# Altium schematic sheet TSAL分布图.SchDoc
size A4; SheetNumber: 7; SheetTotal: 9
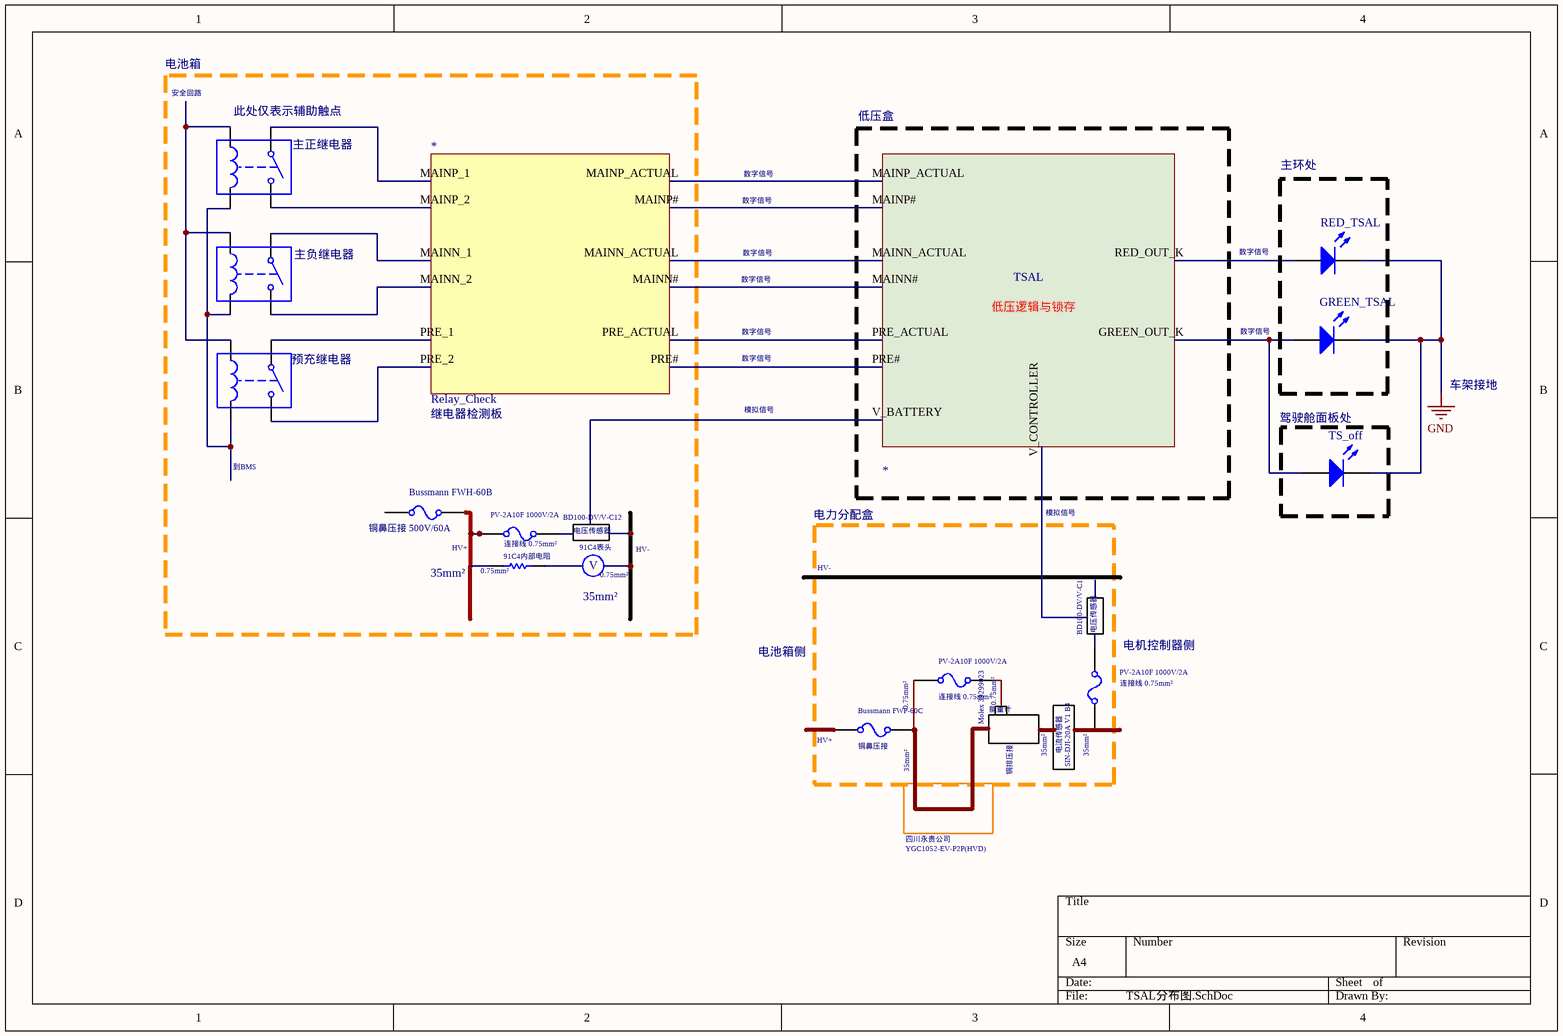
[diagram p0: TSAL分布图.SchDoc]

## Parts
(Parts that share a designator on the sheet are numbered #1, #2 ... from top to bottom, then left to right.)
91C4内部电阻  Resistor  (value not drawn)
*#1  Relay_Check
*#2  TSAL
Bussmann_FWH-60B  Fuse  (value not drawn)
Bussmann_FWP-60C  CURRENT: 铜鼻压接  (hidden comment: Fuse)
GREEN_TSAL  Light-Emitting Diode  (value not drawn)
PV-2A10F_1000V/2A#1  连接线 0.75mm²
PV-2A10F_1000V/2A#2  连接线 0.75mm²
PV-2A10F_1000V/2A#3  连接线 0.75mm²
RED_TSAL  Light-Emitting Diode  (value not drawn)
TS_off  Light-Emitting Diode  (value not drawn)
主正继电器  Single-Pole, Single-Throw Normally Opened Relay  (value not drawn)
主负继电器  Single-Pole, Single-Throw Normally Opened Relay  (value not drawn)
预充继电器  Single-Pole, Single-Throw Normally Opened Relay  (value not drawn)

## Blocks framed on the sheet
主环处: GREEN_TSAL RED_TSAL
驾驶舱面板处: TS_off
电力分配盒: Bussmann_FWP-60C PV-2A10F_1000V/2A#2 PV-2A10F_1000V/2A#3

## Sub-sheets
电池箱 = YGC1052-EV-P2P(HVD): no entries
电池箱 = 能量计: no entries

## Nets
GND: GREEN_TSAL.2(K) RED_TSAL.2(K) TS_off.2(K)
Net91C4内部电阻_1: 91C4内部电阻.1 Bussmann_FWH-60B.1 PV-2A10F_1000V/2A#1.1
Net*#1_MAINN#: *#1.MAINN# *#2.MAINN#
Net*#1_MAINN_1: *#1.MAINN_1 主负继电器.1
Net*#1_MAINN_2: *#1.MAINN_2 主负继电器.2
Net*#1_MAINN_ACTUAL: *#1.MAINN_ACTUAL *#2.MAINN_ACTUAL
Net*#1_MAINP#: *#1.MAINP# *#2.MAINP#
Net*#1_MAINP_1: *#1.MAINP_1 主正继电器.1
Net*#1_MAINP_2: *#1.MAINP_2 主正继电器.2
Net*#1_MAINP_ACTUAL: *#1.MAINP_ACTUAL *#2.MAINP_ACTUAL
Net*#1_PRE#: *#1.PRE# *#2.PRE#
Net*#1_PRE_1: *#1.PRE_1 预充继电器.1
Net*#1_PRE_2: *#1.PRE_2 预充继电器.2
Net*#1_PRE_ACTUAL: *#1.PRE_ACTUAL *#2.PRE_ACTUAL
Net*#2_GREEN_OUT_K: *#2.GREEN_OUT_K GREEN_TSAL.1(A) TS_off.1(A)
Net*#2_RED_OUT_K: *#2.RED_OUT_K RED_TSAL.1(A)
NetBussmann_FWP-60C_2: Bussmann_FWP-60C.2 PV-2A10F_1000V/2A#2.2
Net主正继电器_3: 主正继电器.3 主负继电器.3 预充继电器.3
Net主正继电器_4: 主正继电器.4 主负继电器.4 预充继电器.4

Not connected (* = marked no-connect by the designer): 91C4内部电阻 2; *#2 V_BATTERY V_CONTROLLER; Bussmann_FWH-60B 2; Bussmann_FWP-60C 1; PV-2A10F_1000V/2A#1 2; PV-2A10F_1000V/2A#2 1; PV-2A10F_1000V/2A#3 1 2

## Notes on the sheet
- 电池箱
- 安全回路
- (near 主正继电器) 此处仅表示辅助触点
- 数字信号
- 低压盒
- (near *#2) 低压逻辑与锁存
- (near *#1) 继电器检测板
- 模拟信号
- 车架接地
- 到BMS
- (near PV-2A10F_1000V/2A#1) BD100-DV/V-C12
- (near *#2) 模拟信号
- (near Bussmann_FWH-60B) 铜鼻压接 500V/60A
- 35mm²
- HV+
- (near 91C4内部电阻) 0.75mm²
- 电压传感器
- 91C4表头
- V
- 0.75mm²
- HV-
- (near PV-2A10F_1000V/2A#3) BD100-DV/V-C12
- (near PV-2A10F_1000V/2A#3) 电压传感器
- (near PV-2A10F_1000V/2A#3) 电机控制器侧
- 电池箱侧
- (near PV-2A10F_1000V/2A#2) Molex 39299023
- (near PV-2A10F_1000V/2A#2) 0.75mm²
- (near Bussmann_FWP-60C) HV+
- (near Bussmann_FWP-60C) 35mm²
- 铜排压接
- (near PV-2A10F_1000V/2A#3) 电流传感器
- (near PV-2A10F_1000V/2A#3) SIN-DJI-20A V1 B4
- (near PV-2A10F_1000V/2A#3) 35mm²
- 四川永贵公司

## Library data of the parts
91C4内部电阻 = Resistor: TC1: 0; SimulationGenericComponent: True; Value: 1K; TC2: 0
Bussmann_FWH-60B PV-2A10F_1000V/2A#1-PV-2A10F_1000V/2A#3 = Fuse: RESISTANCE: 1m; SimulationGenericComponent: True; CURRENT: 1
Bussmann_FWP-60C = Fuse: RESISTANCE: 1m; SimulationGenericComponent: True
GREEN_TSAL RED_TSAL TS_off = LED: AF: 1; BV: 0; BV_MAX: 1e99; EG: 1.11; FC: 0.5; IBV: 0.001; IS: 1e-14; MJSW: 0.33; NTUN: 30; TNOM: 27; XTI: 3; SimulationGenericComponent: True; CJO: 0; CJP: 0; CTA: 0; CTP: 0; FCS: 0.5; FV_MAX: 1e99; IKF: 0; IKR: 0; ISR: 1e-14; JSW: 0; JTUN: 0; JTUNSW: 0; KEG: 1; KF: 0; LEVEL: 1; N: 1; NBV: 1; NR: 1; NS: 1; PHP: 1; RS: 0; TCV: 0; TLEV: 0; TLEVC: 0; TM1: 0; TM2: 0; TPB: 0; TPHP: 0; TRS: 0; TRS2: 0; TT: 0; TTT1: 0; TTT2: 0; VJ: 1; XTITUN: 3
主正继电器 主负继电器 预充继电器 = SPST Relay NO: L_C: 1u; R_C: 100; RON: 1; ROFF: 1e12; ION: 1m; IOFF: 0; SimulationGenericComponent: True